# EAGLE schematic Index Registers - 1.1 (EAGLE 9.6.2)

## Sheet 1 of 8: R0
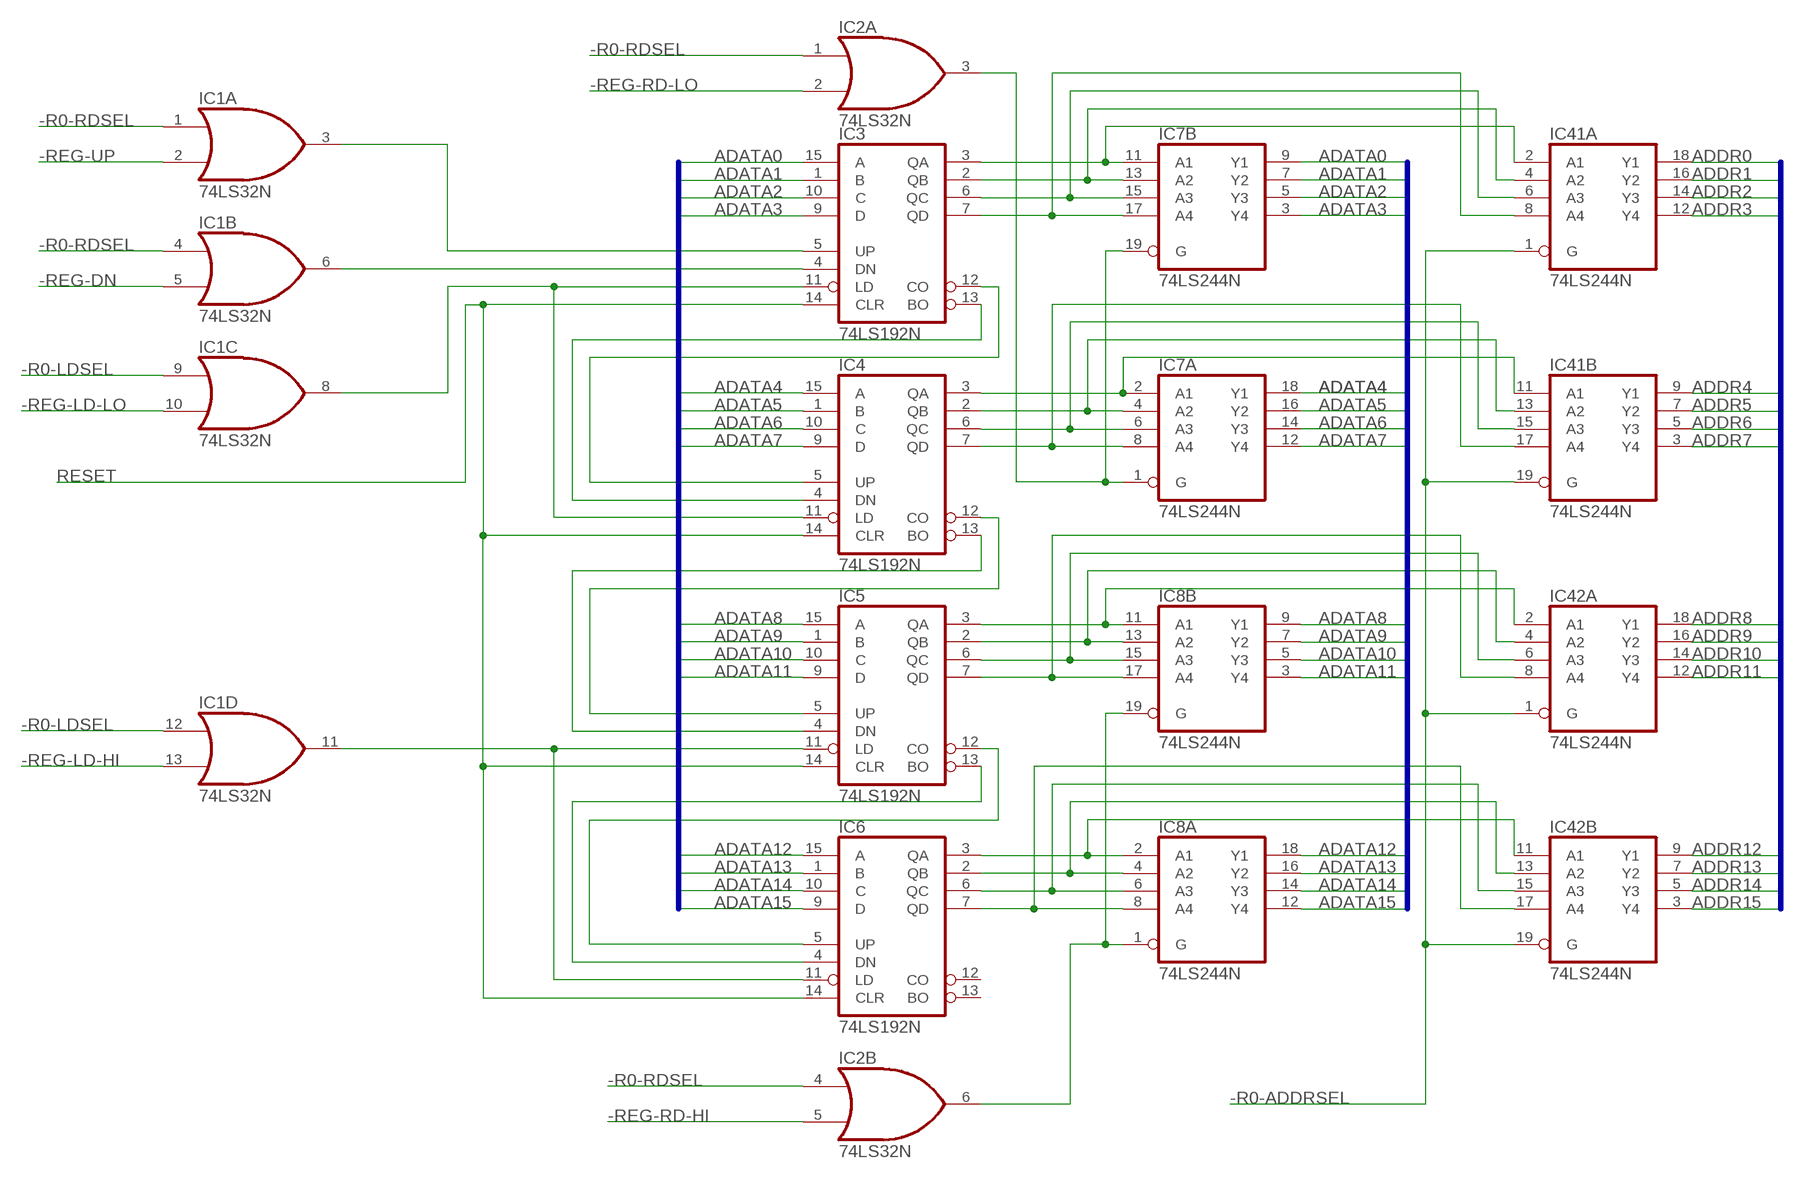
[diagram p0: schematic, sheet 1]

### Parts
IC1  74LS32N  [DIL14]
IC2  74LS32N  [DIL14]
IC3  74LS192N  [DIL16]
IC4  74LS192N  [DIL16]
IC5  74LS192N  [DIL16]
IC6  74LS192N  [DIL16]
IC7  74LS244N  [DIL20]
IC8  74LS244N  [DIL20]
IC41  74LS244N  [DIL20]
IC42  74LS244N  [DIL20]

### Nets
-R0-ADDRSEL: IC41.1(A:G) IC41.19(B:G) IC42.1(A:G) IC42.19(B:G) ; also sheet 6
-R0-LDSEL: IC1.9(C:I0) IC1.12(D:I0) ; also sheet 6
-R0-RDSEL: IC1.1(A:I0) IC1.4(B:I0) IC2.1(A:I0) IC2.4(B:I0) ; also sheet 6
-REG-DN: IC1.5(B:I1) ; also sheet 2,3,4,8
-REG-LD-HI: IC1.13(D:I1) ; also sheet 2,3,4,8
-REG-LD-LO: IC1.10(C:I1) ; also sheet 2,3,4,8
-REG-RD-HI: IC2.5(B:I1) ; also sheet 2,3,4,8
-REG-RD-LO: IC2.2(A:I1) ; also sheet 2,3,4,8
-REG-UP: IC1.2(A:I1) ; also sheet 2,3,4,8
ADATA0: IC3.15(A) IC7.9(B:Y1) ; also sheet 2,3,4,5,7
ADATA1: IC3.1(B) IC7.7(B:Y2) ; also sheet 2,3,4,5,7
ADATA2: IC3.10(C) IC7.5(B:Y3) ; also sheet 2,3,4,5,7
ADATA3: IC3.9(D) IC7.3(B:Y4) ; also sheet 2,3,4,5,7
ADATA4: IC4.15(A) IC7.18(A:Y1) ; also sheet 2,3,4,5,7
ADATA5: IC4.1(B) IC7.16(A:Y2) ; also sheet 2,3,4,5,7
ADATA6: IC4.10(C) IC7.14(A:Y3) ; also sheet 2,3,4,5,7
ADATA7: IC4.9(D) IC7.12(A:Y4) ; also sheet 2,3,4,5,7
ADATA8: IC5.15(A) IC8.9(B:Y1) ; also sheet 2,3,4,5,7
ADATA9: IC5.1(B) IC8.7(B:Y2) ; also sheet 2,3,4,5,7
ADATA10: IC5.10(C) IC8.5(B:Y3) ; also sheet 2,3,4,5,7
ADATA11: IC5.9(D) IC8.3(B:Y4) ; also sheet 2,3,4,5,7
ADATA12: IC6.15(A) IC8.18(A:Y1) ; also sheet 2,3,4,5,7
ADATA13: IC6.1(B) IC8.16(A:Y2) ; also sheet 2,3,4,5,7
ADATA14: IC6.10(C) IC8.14(A:Y3) ; also sheet 2,3,4,5,7
ADATA15: IC6.9(D) IC8.12(A:Y4) ; also sheet 2,3,4,5,7
ADDR0: IC41.18(A:Y1) ; also sheet 2,3,4,8
ADDR1: IC41.16(A:Y2) ; also sheet 2,3,4,8
ADDR2: IC41.14(A:Y3) ; also sheet 2,3,4,8
ADDR3: IC41.12(A:Y4) ; also sheet 2,3,4,8
ADDR4: IC41.9(B:Y1) ; also sheet 2,3,4,8
ADDR5: IC41.7(B:Y2) ; also sheet 2,3,4,8
ADDR6: IC41.5(B:Y3) ; also sheet 2,3,4,8
ADDR7: IC41.3(B:Y4) ; also sheet 2,3,4,8
ADDR8: IC42.18(A:Y1) ; also sheet 2,3,4,8
ADDR9: IC42.16(A:Y2) ; also sheet 2,3,4,8
ADDR10: IC42.14(A:Y3) ; also sheet 2,3,4,8
ADDR11: IC42.12(A:Y4) ; also sheet 2,3,4,8
ADDR12: IC42.9(B:Y1) ; also sheet 2,3,4,8
ADDR13: IC42.7(B:Y2) ; also sheet 2,3,4,8
ADDR14: IC42.5(B:Y3) ; also sheet 2,3,4,8
ADDR15: IC42.3(B:Y4) ; also sheet 2,3,4,8
N$10: IC3.13(BO) IC4.4(DN)
N$11: IC3.12(CO) IC4.5(UP)
N$12: IC4.13(BO) IC5.4(DN)
N$13: IC4.12(CO) IC5.5(UP)
N$14: IC5.13(BO) IC6.4(DN)
N$15: IC5.12(CO) IC6.5(UP)
N$16: IC1.8(C:O) IC3.11(LD) IC4.11(LD)
N$17: IC1.3(A:O) IC3.5(UP)
N$18: IC1.6(B:O) IC3.4(DN)
N$20: IC2.3(A:O) IC7.1(A:G) IC7.19(B:G)
N$21: IC2.6(B:O) IC8.1(A:G) IC8.19(B:G)
N$22: IC1.11(D:O) IC5.11(LD) IC6.11(LD)
N$115: IC3.3(QA) IC7.11(B:A1) IC41.2(A:A1)
N$116: IC3.2(QB) IC7.13(B:A2) IC41.4(A:A2)
N$117: IC3.6(QC) IC7.15(B:A3) IC41.6(A:A3)
N$118: IC3.7(QD) IC7.17(B:A4) IC41.8(A:A4)
N$119: IC4.3(QA) IC7.2(A:A1) IC41.11(B:A1)
N$120: IC4.2(QB) IC7.4(A:A2) IC41.13(B:A2)
N$121: IC4.6(QC) IC7.6(A:A3) IC41.15(B:A3)
N$122: IC4.7(QD) IC7.8(A:A4) IC41.17(B:A4)
N$123: IC5.3(QA) IC8.11(B:A1) IC42.2(A:A1)
N$124: IC5.2(QB) IC8.13(B:A2) IC42.4(A:A2)
N$125: IC5.6(QC) IC8.15(B:A3) IC42.6(A:A3)
N$126: IC5.7(QD) IC8.17(B:A4) IC42.8(A:A4)
N$127: IC6.3(QA) IC8.2(A:A1) IC42.11(B:A1)
N$128: IC6.2(QB) IC8.4(A:A2) IC42.13(B:A2)
N$129: IC6.6(QC) IC8.6(A:A3) IC42.15(B:A3)
N$130: IC6.7(QD) IC8.8(A:A4) IC42.17(B:A4)
RESET: IC3.14(CLR) IC4.14(CLR) IC5.14(CLR) IC6.14(CLR) ; also sheet 2,3,4,7
Unconnected: IC6.12(CO) IC6.13(BO)

### Buses
ADATA[0..15]
ADDRBUS:ADDR[0..15]

## Sheet 2 of 8: R1
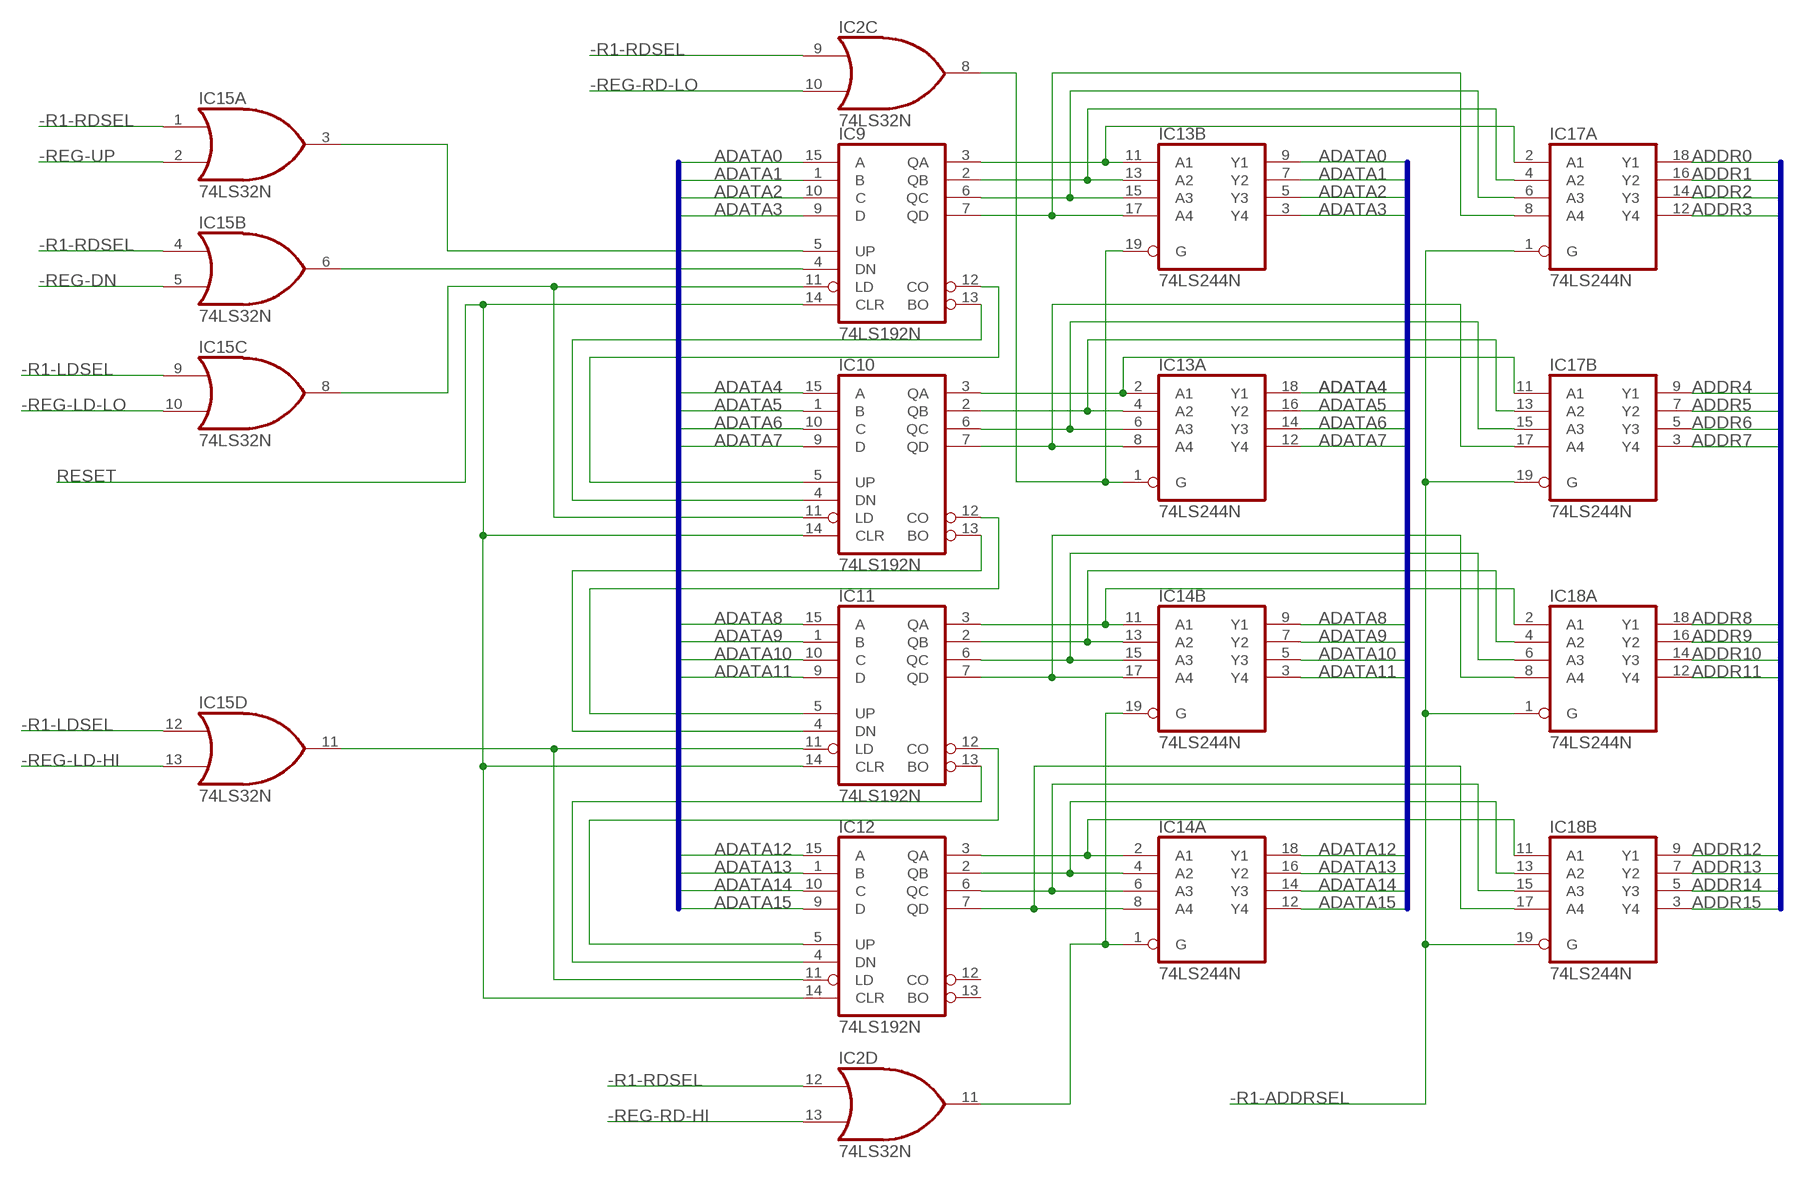
[diagram p1: schematic, sheet 2]

### Parts
IC9  74LS192N  [DIL16]
IC10  74LS192N  [DIL16]
IC11  74LS192N  [DIL16]
IC12  74LS192N  [DIL16]
IC13  74LS244N  [DIL20]
IC14  74LS244N  [DIL20]
IC15  74LS32N  [DIL14]
IC17  74LS244N  [DIL20]
IC18  74LS244N  [DIL20]

### Nets
-R1-ADDRSEL: IC17.1(A:G) IC17.19(B:G) IC18.1(A:G) IC18.19(B:G) ; also sheet 6
-R1-LDSEL: IC15.9(C:I0) IC15.12(D:I0) ; also sheet 6
-R1-RDSEL: IC2.9(C:I0) IC2.12(D:I0) IC15.1(A:I0) IC15.4(B:I0) ; also sheet 6
-REG-DN: IC15.5(B:I1) ; also sheet 1,3,4,8
-REG-LD-HI: IC15.13(D:I1) ; also sheet 1,3,4,8
-REG-LD-LO: IC15.10(C:I1) ; also sheet 1,3,4,8
-REG-RD-HI: IC2.13(D:I1) ; also sheet 1,3,4,8
-REG-RD-LO: IC2.10(C:I1) ; also sheet 1,3,4,8
-REG-UP: IC15.2(A:I1) ; also sheet 1,3,4,8
ADATA0: IC9.15(A) IC13.9(B:Y1) ; also sheet 1,3,4,5,7
ADATA1: IC9.1(B) IC13.7(B:Y2) ; also sheet 1,3,4,5,7
ADATA2: IC9.10(C) IC13.5(B:Y3) ; also sheet 1,3,4,5,7
ADATA3: IC9.9(D) IC13.3(B:Y4) ; also sheet 1,3,4,5,7
ADATA4: IC10.15(A) IC13.18(A:Y1) ; also sheet 1,3,4,5,7
ADATA5: IC10.1(B) IC13.16(A:Y2) ; also sheet 1,3,4,5,7
ADATA6: IC10.10(C) IC13.14(A:Y3) ; also sheet 1,3,4,5,7
ADATA7: IC10.9(D) IC13.12(A:Y4) ; also sheet 1,3,4,5,7
ADATA8: IC11.15(A) IC14.9(B:Y1) ; also sheet 1,3,4,5,7
ADATA9: IC11.1(B) IC14.7(B:Y2) ; also sheet 1,3,4,5,7
ADATA10: IC11.10(C) IC14.5(B:Y3) ; also sheet 1,3,4,5,7
ADATA11: IC11.9(D) IC14.3(B:Y4) ; also sheet 1,3,4,5,7
ADATA12: IC12.15(A) IC14.18(A:Y1) ; also sheet 1,3,4,5,7
ADATA13: IC12.1(B) IC14.16(A:Y2) ; also sheet 1,3,4,5,7
ADATA14: IC12.10(C) IC14.14(A:Y3) ; also sheet 1,3,4,5,7
ADATA15: IC12.9(D) IC14.12(A:Y4) ; also sheet 1,3,4,5,7
ADDR0: IC17.18(A:Y1) ; also sheet 1,3,4,8
ADDR1: IC17.16(A:Y2) ; also sheet 1,3,4,8
ADDR2: IC17.14(A:Y3) ; also sheet 1,3,4,8
ADDR3: IC17.12(A:Y4) ; also sheet 1,3,4,8
ADDR4: IC17.9(B:Y1) ; also sheet 1,3,4,8
ADDR5: IC17.7(B:Y2) ; also sheet 1,3,4,8
ADDR6: IC17.5(B:Y3) ; also sheet 1,3,4,8
ADDR7: IC17.3(B:Y4) ; also sheet 1,3,4,8
ADDR8: IC18.18(A:Y1) ; also sheet 1,3,4,8
ADDR9: IC18.16(A:Y2) ; also sheet 1,3,4,8
ADDR10: IC18.14(A:Y3) ; also sheet 1,3,4,8
ADDR11: IC18.12(A:Y4) ; also sheet 1,3,4,8
ADDR12: IC18.9(B:Y1) ; also sheet 1,3,4,8
ADDR13: IC18.7(B:Y2) ; also sheet 1,3,4,8
ADDR14: IC18.5(B:Y3) ; also sheet 1,3,4,8
ADDR15: IC18.3(B:Y4) ; also sheet 1,3,4,8
N$2: IC9.13(BO) IC10.4(DN)
N$3: IC9.12(CO) IC10.5(UP)
N$4: IC10.13(BO) IC11.4(DN)
N$5: IC10.12(CO) IC11.5(UP)
N$6: IC11.13(BO) IC12.4(DN)
N$7: IC11.12(CO) IC12.5(UP)
N$8: IC9.11(LD) IC10.11(LD) IC15.8(C:O)
N$9: IC9.5(UP) IC15.3(A:O)
N$23: IC9.4(DN) IC15.6(B:O)
N$25: IC2.8(C:O) IC13.1(A:G) IC13.19(B:G)
N$26: IC2.11(D:O) IC14.1(A:G) IC14.19(B:G)
N$27: IC11.11(LD) IC12.11(LD) IC15.11(D:O)
N$28: IC9.3(QA) IC13.11(B:A1) IC17.2(A:A1)
N$29: IC9.2(QB) IC13.13(B:A2) IC17.4(A:A2)
N$30: IC9.6(QC) IC13.15(B:A3) IC17.6(A:A3)
N$31: IC9.7(QD) IC13.17(B:A4) IC17.8(A:A4)
N$32: IC10.3(QA) IC13.2(A:A1) IC17.11(B:A1)
N$33: IC10.2(QB) IC13.4(A:A2) IC17.13(B:A2)
N$34: IC10.6(QC) IC13.6(A:A3) IC17.15(B:A3)
N$35: IC10.7(QD) IC13.8(A:A4) IC17.17(B:A4)
N$36: IC11.3(QA) IC14.11(B:A1) IC18.2(A:A1)
N$38: IC11.2(QB) IC14.13(B:A2) IC18.4(A:A2)
N$39: IC11.6(QC) IC14.15(B:A3) IC18.6(A:A3)
N$40: IC11.7(QD) IC14.17(B:A4) IC18.8(A:A4)
N$54: IC12.3(QA) IC14.2(A:A1) IC18.11(B:A1)
N$55: IC12.2(QB) IC14.4(A:A2) IC18.13(B:A2)
N$56: IC12.6(QC) IC14.6(A:A3) IC18.15(B:A3)
N$57: IC12.7(QD) IC14.8(A:A4) IC18.17(B:A4)
RESET: IC9.14(CLR) IC10.14(CLR) IC11.14(CLR) IC12.14(CLR) ; also sheet 1,3,4,7
Unconnected: IC12.12(CO) IC12.13(BO)

### Buses
ADATA[0..15]
ADDRBUS:ADDR[0..15]

## Sheet 3 of 8: R2
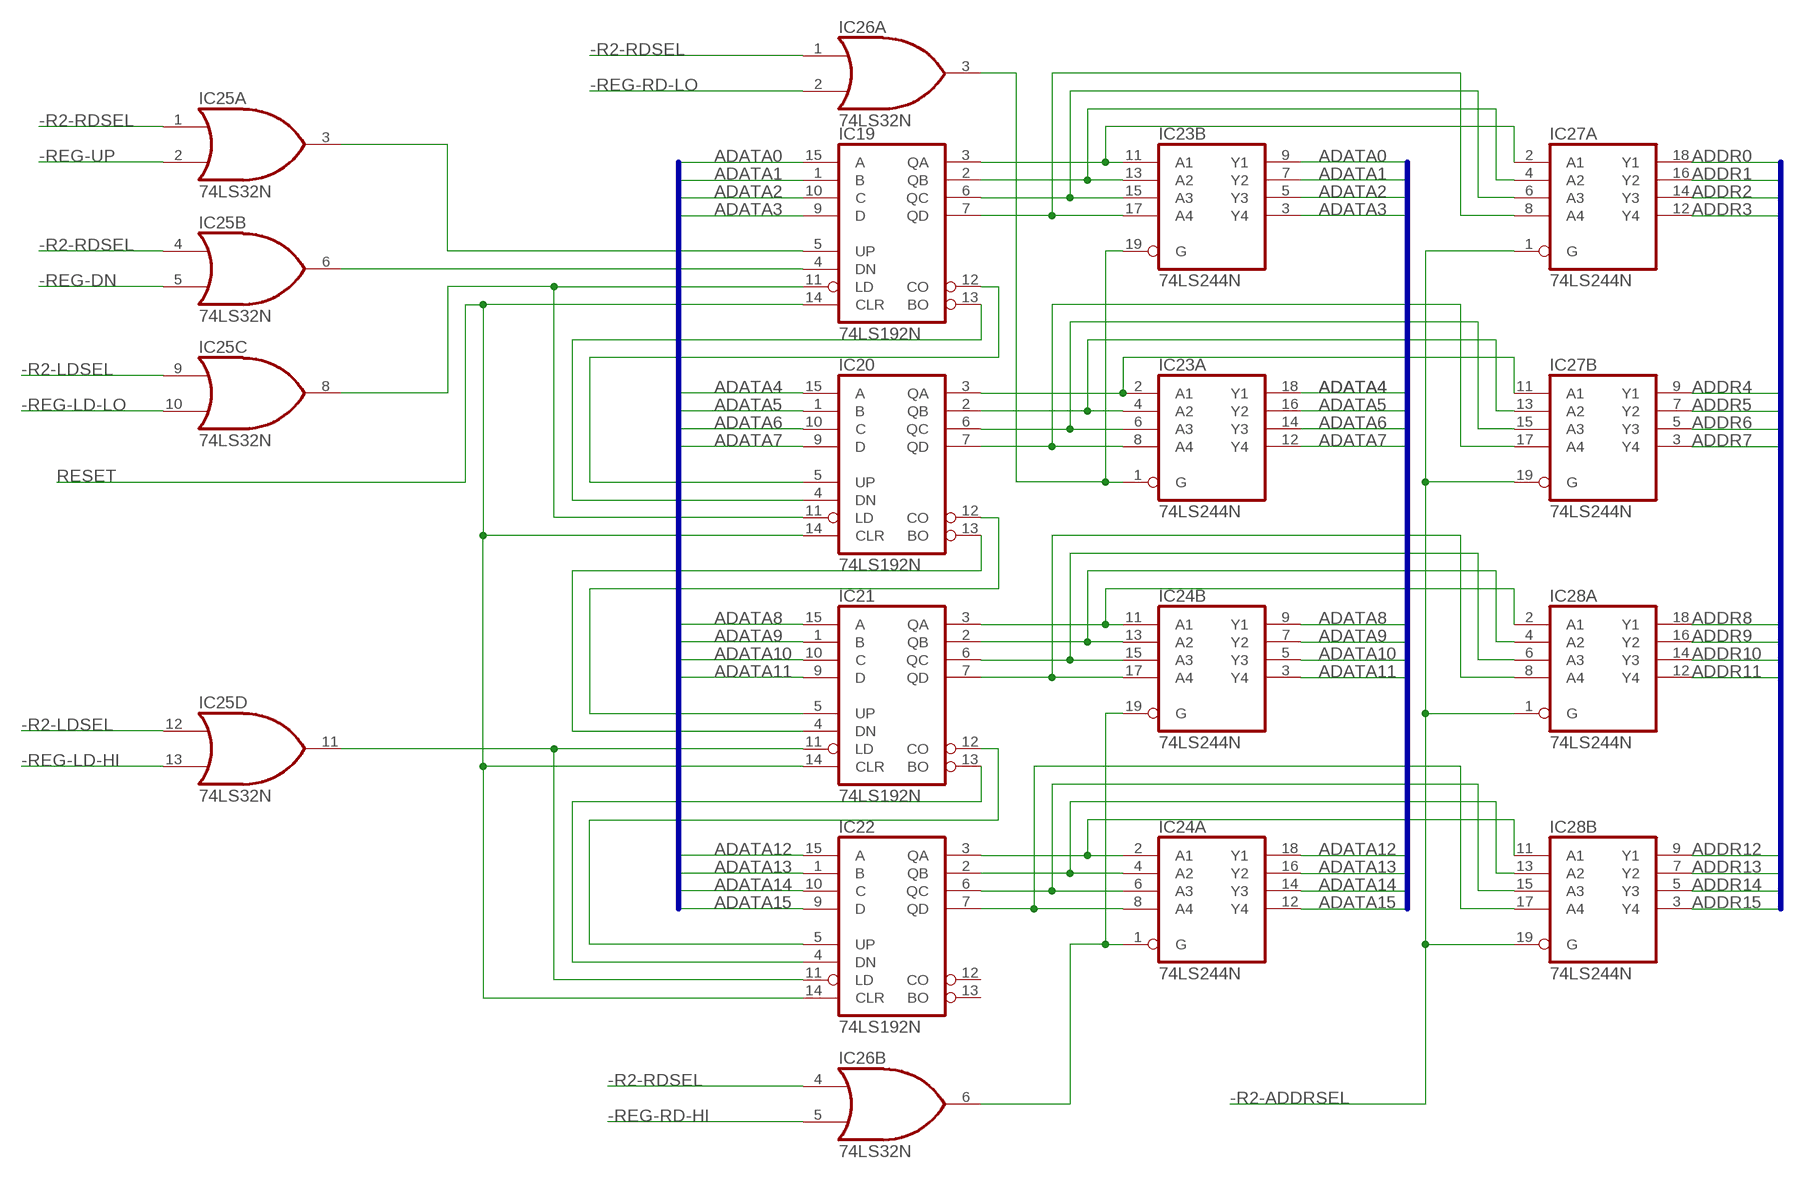
[diagram p2: schematic, sheet 3]

### Parts
IC19  74LS192N  [DIL16]
IC20  74LS192N  [DIL16]
IC21  74LS192N  [DIL16]
IC22  74LS192N  [DIL16]
IC23  74LS244N  [DIL20]
IC24  74LS244N  [DIL20]
IC25  74LS32N  [DIL14]
IC26  74LS32N  [DIL14]
IC27  74LS244N  [DIL20]
IC28  74LS244N  [DIL20]

### Nets
-R2-ADDRSEL: IC27.1(A:G) IC27.19(B:G) IC28.1(A:G) IC28.19(B:G) ; also sheet 6
-R2-LDSEL: IC25.9(C:I0) IC25.12(D:I0) ; also sheet 6
-R2-RDSEL: IC25.1(A:I0) IC25.4(B:I0) IC26.1(A:I0) IC26.4(B:I0) ; also sheet 6
-REG-DN: IC25.5(B:I1) ; also sheet 1,2,4,8
-REG-LD-HI: IC25.13(D:I1) ; also sheet 1,2,4,8
-REG-LD-LO: IC25.10(C:I1) ; also sheet 1,2,4,8
-REG-RD-HI: IC26.5(B:I1) ; also sheet 1,2,4,8
-REG-RD-LO: IC26.2(A:I1) ; also sheet 1,2,4,8
-REG-UP: IC25.2(A:I1) ; also sheet 1,2,4,8
ADATA0: IC19.15(A) IC23.9(B:Y1) ; also sheet 1,2,4,5,7
ADATA1: IC19.1(B) IC23.7(B:Y2) ; also sheet 1,2,4,5,7
ADATA2: IC19.10(C) IC23.5(B:Y3) ; also sheet 1,2,4,5,7
ADATA3: IC19.9(D) IC23.3(B:Y4) ; also sheet 1,2,4,5,7
ADATA4: IC20.15(A) IC23.18(A:Y1) ; also sheet 1,2,4,5,7
ADATA5: IC20.1(B) IC23.16(A:Y2) ; also sheet 1,2,4,5,7
ADATA6: IC20.10(C) IC23.14(A:Y3) ; also sheet 1,2,4,5,7
ADATA7: IC20.9(D) IC23.12(A:Y4) ; also sheet 1,2,4,5,7
ADATA8: IC21.15(A) IC24.9(B:Y1) ; also sheet 1,2,4,5,7
ADATA9: IC21.1(B) IC24.7(B:Y2) ; also sheet 1,2,4,5,7
ADATA10: IC21.10(C) IC24.5(B:Y3) ; also sheet 1,2,4,5,7
ADATA11: IC21.9(D) IC24.3(B:Y4) ; also sheet 1,2,4,5,7
ADATA12: IC22.15(A) IC24.18(A:Y1) ; also sheet 1,2,4,5,7
ADATA13: IC22.1(B) IC24.16(A:Y2) ; also sheet 1,2,4,5,7
ADATA14: IC22.10(C) IC24.14(A:Y3) ; also sheet 1,2,4,5,7
ADATA15: IC22.9(D) IC24.12(A:Y4) ; also sheet 1,2,4,5,7
ADDR0: IC27.18(A:Y1) ; also sheet 1,2,4,8
ADDR1: IC27.16(A:Y2) ; also sheet 1,2,4,8
ADDR2: IC27.14(A:Y3) ; also sheet 1,2,4,8
ADDR3: IC27.12(A:Y4) ; also sheet 1,2,4,8
ADDR4: IC27.9(B:Y1) ; also sheet 1,2,4,8
ADDR5: IC27.7(B:Y2) ; also sheet 1,2,4,8
ADDR6: IC27.5(B:Y3) ; also sheet 1,2,4,8
ADDR7: IC27.3(B:Y4) ; also sheet 1,2,4,8
ADDR8: IC28.18(A:Y1) ; also sheet 1,2,4,8
ADDR9: IC28.16(A:Y2) ; also sheet 1,2,4,8
ADDR10: IC28.14(A:Y3) ; also sheet 1,2,4,8
ADDR11: IC28.12(A:Y4) ; also sheet 1,2,4,8
ADDR12: IC28.9(B:Y1) ; also sheet 1,2,4,8
ADDR13: IC28.7(B:Y2) ; also sheet 1,2,4,8
ADDR14: IC28.5(B:Y3) ; also sheet 1,2,4,8
ADDR15: IC28.3(B:Y4) ; also sheet 1,2,4,8
N$58: IC19.13(BO) IC20.4(DN)
N$59: IC19.12(CO) IC20.5(UP)
N$60: IC20.13(BO) IC21.4(DN)
N$61: IC20.12(CO) IC21.5(UP)
N$62: IC21.13(BO) IC22.4(DN)
N$63: IC21.12(CO) IC22.5(UP)
N$64: IC19.11(LD) IC20.11(LD) IC25.8(C:O)
N$65: IC19.5(UP) IC25.3(A:O)
N$66: IC19.4(DN) IC25.6(B:O)
N$67: IC23.1(A:G) IC23.19(B:G) IC26.3(A:O)
N$68: IC24.1(A:G) IC24.19(B:G) IC26.6(B:O)
N$69: IC21.11(LD) IC22.11(LD) IC25.11(D:O)
N$70: IC19.3(QA) IC23.11(B:A1) IC27.2(A:A1)
N$71: IC19.2(QB) IC23.13(B:A2) IC27.4(A:A2)
N$72: IC19.6(QC) IC23.15(B:A3) IC27.6(A:A3)
N$73: IC19.7(QD) IC23.17(B:A4) IC27.8(A:A4)
N$74: IC20.3(QA) IC23.2(A:A1) IC27.11(B:A1)
N$75: IC20.2(QB) IC23.4(A:A2) IC27.13(B:A2)
N$76: IC20.6(QC) IC23.6(A:A3) IC27.15(B:A3)
N$77: IC20.7(QD) IC23.8(A:A4) IC27.17(B:A4)
N$78: IC21.3(QA) IC24.11(B:A1) IC28.2(A:A1)
N$79: IC21.2(QB) IC24.13(B:A2) IC28.4(A:A2)
N$80: IC21.6(QC) IC24.15(B:A3) IC28.6(A:A3)
N$81: IC21.7(QD) IC24.17(B:A4) IC28.8(A:A4)
N$82: IC22.3(QA) IC24.2(A:A1) IC28.11(B:A1)
N$83: IC22.2(QB) IC24.4(A:A2) IC28.13(B:A2)
N$84: IC22.6(QC) IC24.6(A:A3) IC28.15(B:A3)
N$85: IC22.7(QD) IC24.8(A:A4) IC28.17(B:A4)
RESET: IC19.14(CLR) IC20.14(CLR) IC21.14(CLR) IC22.14(CLR) ; also sheet 1,2,4,7
Unconnected: IC22.12(CO) IC22.13(BO)

### Buses
ADATA[0..15]
ADDRBUS:ADDR[0..15]

## Sheet 4 of 8: R3
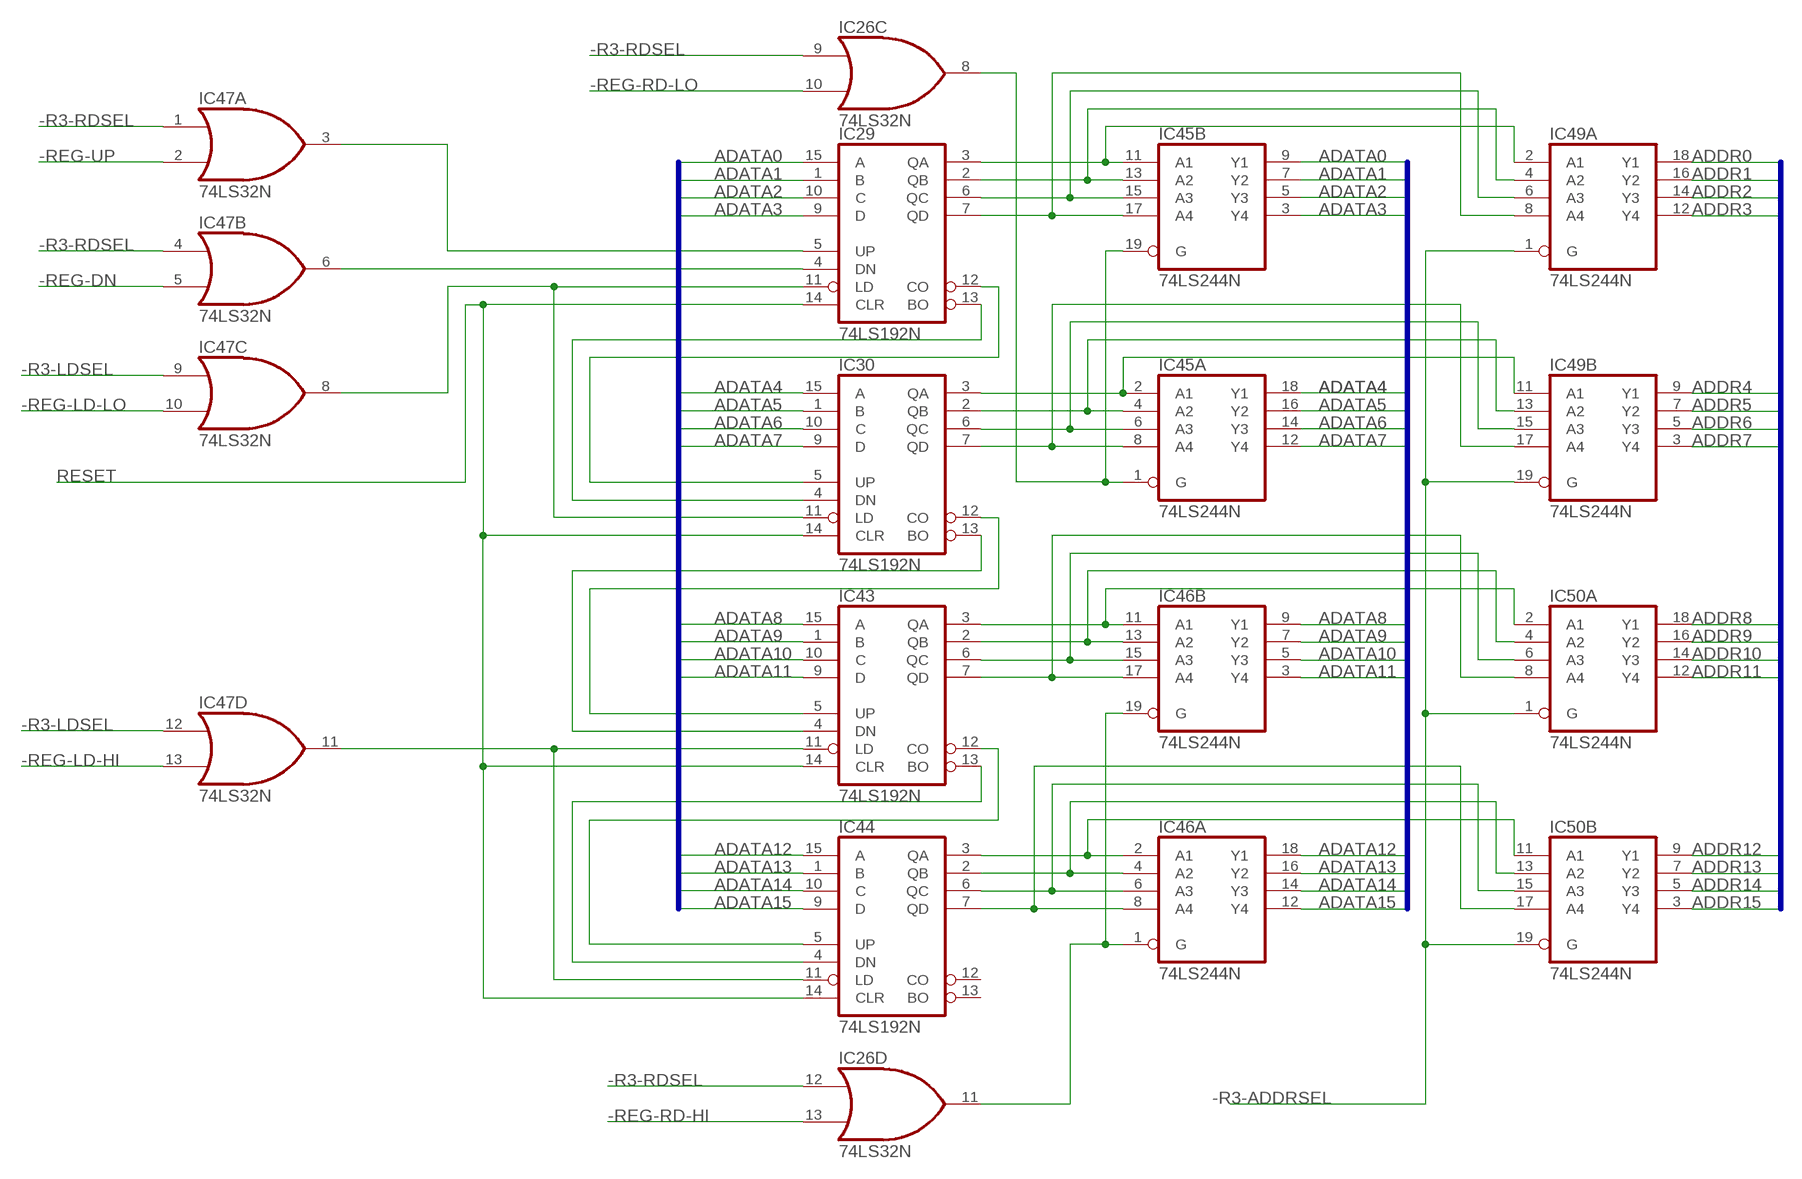
[diagram p3: schematic, sheet 4]

### Parts
IC29  74LS192N  [DIL16]
IC30  74LS192N  [DIL16]
IC43  74LS192N  [DIL16]
IC44  74LS192N  [DIL16]
IC45  74LS244N  [DIL20]
IC46  74LS244N  [DIL20]
IC47  74LS32N  [DIL14]
IC49  74LS244N  [DIL20]
IC50  74LS244N  [DIL20]

### Nets
-R3-ADDRSEL: IC49.1(A:G) IC49.19(B:G) IC50.1(A:G) IC50.19(B:G) ; also sheet 6
-R3-LDSEL: IC47.9(C:I0) IC47.12(D:I0) ; also sheet 6
-R3-RDSEL: IC26.9(C:I0) IC26.12(D:I0) IC47.1(A:I0) IC47.4(B:I0) ; also sheet 6
-REG-DN: IC47.5(B:I1) ; also sheet 1,2,3,8
-REG-LD-HI: IC47.13(D:I1) ; also sheet 1,2,3,8
-REG-LD-LO: IC47.10(C:I1) ; also sheet 1,2,3,8
-REG-RD-HI: IC26.13(D:I1) ; also sheet 1,2,3,8
-REG-RD-LO: IC26.10(C:I1) ; also sheet 1,2,3,8
-REG-UP: IC47.2(A:I1) ; also sheet 1,2,3,8
ADATA0: IC29.15(A) IC45.9(B:Y1) ; also sheet 1,2,3,5,7
ADATA1: IC29.1(B) IC45.7(B:Y2) ; also sheet 1,2,3,5,7
ADATA2: IC29.10(C) IC45.5(B:Y3) ; also sheet 1,2,3,5,7
ADATA3: IC29.9(D) IC45.3(B:Y4) ; also sheet 1,2,3,5,7
ADATA4: IC30.15(A) IC45.18(A:Y1) ; also sheet 1,2,3,5,7
ADATA5: IC30.1(B) IC45.16(A:Y2) ; also sheet 1,2,3,5,7
ADATA6: IC30.10(C) IC45.14(A:Y3) ; also sheet 1,2,3,5,7
ADATA7: IC30.9(D) IC45.12(A:Y4) ; also sheet 1,2,3,5,7
ADATA8: IC43.15(A) IC46.9(B:Y1) ; also sheet 1,2,3,5,7
ADATA9: IC43.1(B) IC46.7(B:Y2) ; also sheet 1,2,3,5,7
ADATA10: IC43.10(C) IC46.5(B:Y3) ; also sheet 1,2,3,5,7
ADATA11: IC43.9(D) IC46.3(B:Y4) ; also sheet 1,2,3,5,7
ADATA12: IC44.15(A) IC46.18(A:Y1) ; also sheet 1,2,3,5,7
ADATA13: IC44.1(B) IC46.16(A:Y2) ; also sheet 1,2,3,5,7
ADATA14: IC44.10(C) IC46.14(A:Y3) ; also sheet 1,2,3,5,7
ADATA15: IC44.9(D) IC46.12(A:Y4) ; also sheet 1,2,3,5,7
ADDR0: IC49.18(A:Y1) ; also sheet 1,2,3,8
ADDR1: IC49.16(A:Y2) ; also sheet 1,2,3,8
ADDR2: IC49.14(A:Y3) ; also sheet 1,2,3,8
ADDR3: IC49.12(A:Y4) ; also sheet 1,2,3,8
ADDR4: IC49.9(B:Y1) ; also sheet 1,2,3,8
ADDR5: IC49.7(B:Y2) ; also sheet 1,2,3,8
ADDR6: IC49.5(B:Y3) ; also sheet 1,2,3,8
ADDR7: IC49.3(B:Y4) ; also sheet 1,2,3,8
ADDR8: IC50.18(A:Y1) ; also sheet 1,2,3,8
ADDR9: IC50.16(A:Y2) ; also sheet 1,2,3,8
ADDR10: IC50.14(A:Y3) ; also sheet 1,2,3,8
ADDR11: IC50.12(A:Y4) ; also sheet 1,2,3,8
ADDR12: IC50.9(B:Y1) ; also sheet 1,2,3,8
ADDR13: IC50.7(B:Y2) ; also sheet 1,2,3,8
ADDR14: IC50.5(B:Y3) ; also sheet 1,2,3,8
ADDR15: IC50.3(B:Y4) ; also sheet 1,2,3,8
N$86: IC29.13(BO) IC30.4(DN)
N$87: IC29.12(CO) IC30.5(UP)
N$88: IC30.13(BO) IC43.4(DN)
N$89: IC30.12(CO) IC43.5(UP)
N$90: IC43.13(BO) IC44.4(DN)
N$91: IC43.12(CO) IC44.5(UP)
N$92: IC29.11(LD) IC30.11(LD) IC47.8(C:O)
N$93: IC29.5(UP) IC47.3(A:O)
N$94: IC29.4(DN) IC47.6(B:O)
N$95: IC26.8(C:O) IC45.1(A:G) IC45.19(B:G)
N$96: IC26.11(D:O) IC46.1(A:G) IC46.19(B:G)
N$97: IC43.11(LD) IC44.11(LD) IC47.11(D:O)
N$98: IC29.3(QA) IC45.11(B:A1) IC49.2(A:A1)
N$99: IC29.2(QB) IC45.13(B:A2) IC49.4(A:A2)
N$100: IC29.6(QC) IC45.15(B:A3) IC49.6(A:A3)
N$101: IC29.7(QD) IC45.17(B:A4) IC49.8(A:A4)
N$102: IC30.3(QA) IC45.2(A:A1) IC49.11(B:A1)
N$103: IC30.2(QB) IC45.4(A:A2) IC49.13(B:A2)
N$104: IC30.6(QC) IC45.6(A:A3) IC49.15(B:A3)
N$105: IC30.7(QD) IC45.8(A:A4) IC49.17(B:A4)
N$106: IC43.3(QA) IC46.11(B:A1) IC50.2(A:A1)
N$107: IC43.2(QB) IC46.13(B:A2) IC50.4(A:A2)
N$108: IC43.6(QC) IC46.15(B:A3) IC50.6(A:A3)
N$109: IC43.7(QD) IC46.17(B:A4) IC50.8(A:A4)
N$110: IC44.3(QA) IC46.2(A:A1) IC50.11(B:A1)
N$111: IC44.2(QB) IC46.4(A:A2) IC50.13(B:A2)
N$112: IC44.6(QC) IC46.6(A:A3) IC50.15(B:A3)
N$113: IC44.7(QD) IC46.8(A:A4) IC50.17(B:A4)
RESET: IC29.14(CLR) IC30.14(CLR) IC43.14(CLR) IC44.14(CLR) ; also sheet 1,2,3,7
Unconnected: IC44.12(CO) IC44.13(BO)

### Buses
ADATA[0..15]
ADDRBUS:ADDR[0..15]

## Sheet 5 of 8: PULLUPS & BYPASS & UNUSED
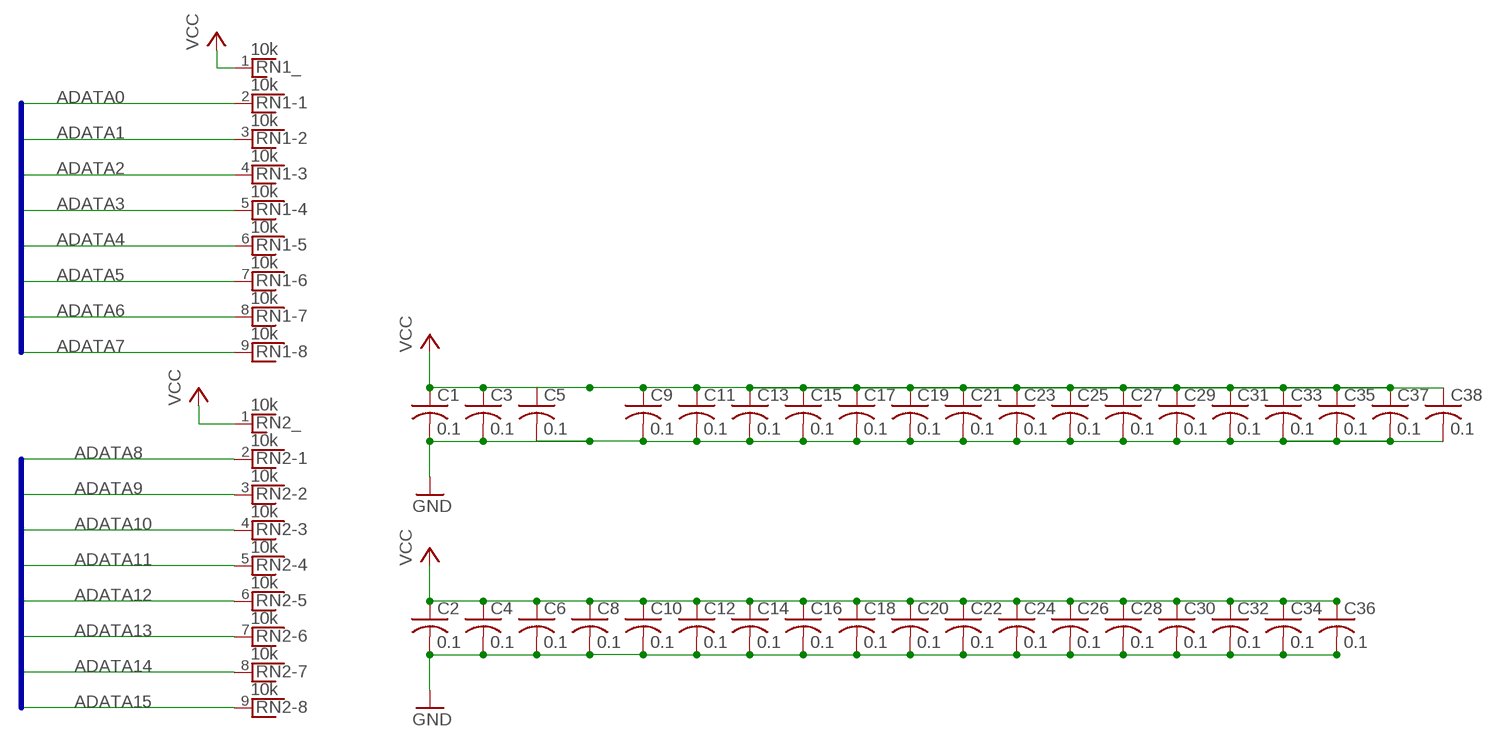
[diagram p4: schematic, sheet 5]

### Parts
C1  0.1  C-US025-040X050  [C025-040X050]
C2  0.1  C-US025-040X050  [C025-040X050]
C3  0.1  C-US025-040X050  [C025-040X050]
C4  0.1  C-US025-040X050  [C025-040X050]
C5  0.1  C-US025-040X050  [C025-040X050]
C6  0.1  C-US025-040X050  [C025-040X050]
C8  0.1  C-US025-040X050  [C025-040X050]
C9  0.1  C-US025-040X050  [C025-040X050]
C10  0.1  C-US025-040X050  [C025-040X050]
C11  0.1  C-US025-040X050  [C025-040X050]
C12  0.1  C-US025-040X050  [C025-040X050]
C13  0.1  C-US025-040X050  [C025-040X050]
C14  0.1  C-US025-040X050  [C025-040X050]
C15  0.1  C-US025-040X050  [C025-040X050]
C16  0.1  C-US025-040X050  [C025-040X050]
C17  0.1  C-US025-040X050  [C025-040X050]
C18  0.1  C-US025-040X050  [C025-040X050]
C19  0.1  C-US025-040X050  [C025-040X050]
C20  0.1  C-US025-040X050  [C025-040X050]
C21  0.1  C-US025-040X050  [C025-040X050]
C22  0.1  C-US025-040X050  [C025-040X050]
C23  0.1  C-US025-040X050  [C025-040X050]
C24  0.1  C-US025-040X050  [C025-040X050]
C25  0.1  C-US025-040X050  [C025-040X050]
C26  0.1  C-US025-040X050  [C025-040X050]
C27  0.1  C-US025-040X050  [C025-040X050]
C28  0.1  C-US025-040X050  [C025-040X050]
C29  0.1  C-US025-040X050  [C025-040X050]
C30  0.1  C-US025-040X050  [C025-040X050]
C31  0.1  C-US025-040X050  [C025-040X050]
C32  0.1  C-US025-040X050  [C025-040X050]
C33  0.1  C-US025-040X050  [C025-040X050]
C34  0.1  C-US025-040X050  [C025-040X050]
C35  0.1  C-US025-040X050  [C025-040X050]
C36  0.1  C-US025-040X050  [C025-040X050]
C37  0.1  C-US025-040X050  [C025-040X050]
C38  0.1  C-US025-040X050  [C025-040X050]
RN1  10k  RNX8  [RN-9]
RN2  10k  RNX8  [RN-9]

### Nets
ADATA0: RN1.2 ; also sheet 1,2,3,4,7
ADATA1: RN1.3 ; also sheet 1,2,3,4,7
ADATA2: RN1.4 ; also sheet 1,2,3,4,7
ADATA3: RN1.5 ; also sheet 1,2,3,4,7
ADATA4: RN1.6 ; also sheet 1,2,3,4,7
ADATA5: RN1.7 ; also sheet 1,2,3,4,7
ADATA6: RN1.8 ; also sheet 1,2,3,4,7
ADATA7: RN1.9 ; also sheet 1,2,3,4,7
ADATA8: RN2.2 ; also sheet 1,2,3,4,7
ADATA9: RN2.3 ; also sheet 1,2,3,4,7
ADATA10: RN2.4 ; also sheet 1,2,3,4,7
ADATA11: RN2.5 ; also sheet 1,2,3,4,7
ADATA12: RN2.6 ; also sheet 1,2,3,4,7
ADATA13: RN2.7 ; also sheet 1,2,3,4,7
ADATA14: RN2.8 ; also sheet 1,2,3,4,7
ADATA15: RN2.9 ; also sheet 1,2,3,4,7
GND: C1.2 C2.2 C3.2 C4.2 C5.2 C6.2 C8.2 C9.2 C10.2 C11.2 C12.2 C13.2 C14.2 C15.2 C16.2 C17.2 C18.2 C19.2 C20.2 C21.2 C22.2 C23.2 C24.2 C25.2 C26.2 C27.2 C28.2 C29.2 C30.2 C31.2 C32.2 C33.2 C34.2 C35.2 C36.2 C37.2 C38.2 ; also sheet 7,8
VCC: C1.1 C2.1 C3.1 C4.1 C5.1 C6.1 C8.1 C9.1 C10.1 C11.1 C12.1 C13.1 C14.1 C15.1 C16.1 C17.1 C18.1 C19.1 C20.1 C21.1 C22.1 C23.1 C24.1 C25.1 C26.1 C27.1 C28.1 C29.1 C30.1 C31.1 C32.1 C33.1 C34.1 C35.1 C36.1 C37.1 C38.1 RN1.1 RN2.1 ; also sheet 8

### Buses
ADATA[0..7]
ADATA[8..15]

## Sheet 6 of 8: Select Logic
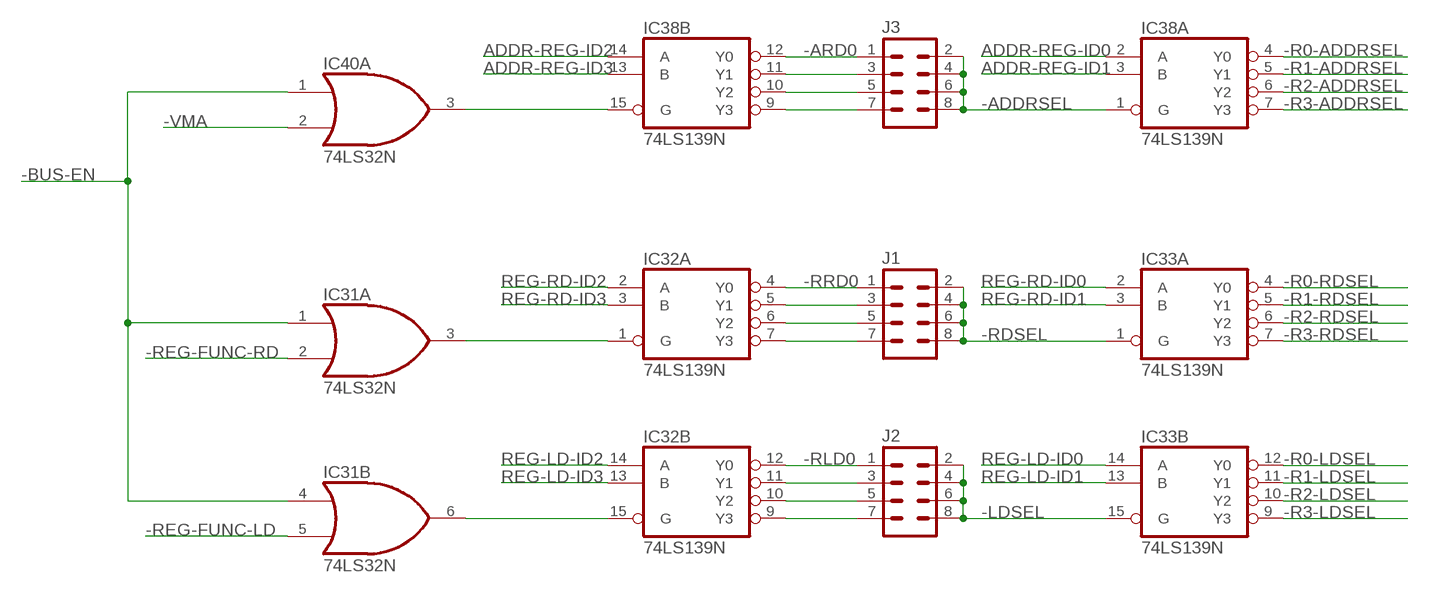
[diagram p5: schematic, sheet 6]

### Parts
IC31  74LS32N  [DIL14]
IC32  74LS139N  [DIL16]
IC33  74LS139N  [DIL16]
IC38  74LS139N  [DIL16]
IC40  74LS32N  [DIL14]
J1  M04X2  [2X4]
J2  M04X2  [2X4]
J3  M04X2  [2X4]

### Nets
-ADDRSEL: IC38.1(A:G) J3.2 J3.4 J3.6 J3.8
-ARD0: IC38.12(B:Y0) J3.1
-BUS-EN: IC31.1(A:I0) IC31.4(B:I0) IC40.1(A:I0) ; also sheet 8
-LDSEL: IC33.15(B:G) J2.2 J2.4 J2.6 J2.8 ; also sheet 7
-R0-ADDRSEL: IC38.4(A:Y0) ; also sheet 1
-R0-LDSEL: IC33.12(B:Y0) ; also sheet 1
-R0-RDSEL: IC33.4(A:Y0) ; also sheet 1
-R1-ADDRSEL: IC38.5(A:Y1) ; also sheet 2
-R1-LDSEL: IC33.11(B:Y1) ; also sheet 2
-R1-RDSEL: IC33.5(A:Y1) ; also sheet 2
-R2-ADDRSEL: IC38.6(A:Y2) ; also sheet 3
-R2-LDSEL: IC33.10(B:Y2) ; also sheet 3
-R2-RDSEL: IC33.6(A:Y2) ; also sheet 3
-R3-ADDRSEL: IC38.7(A:Y3) ; also sheet 4
-R3-LDSEL: IC33.9(B:Y3) ; also sheet 4
-R3-RDSEL: IC33.7(A:Y3) ; also sheet 4
-RDSEL: IC33.1(A:G) J1.2 J1.4 J1.6 J1.8 ; also sheet 7
-REG-FUNC-LD: IC31.5(B:I1) ; also sheet 8
-REG-FUNC-RD: IC31.2(A:I1) ; also sheet 8
-RLD0: IC32.12(B:Y0) J2.1
-RRD0: IC32.4(A:Y0) J1.1
-VMA: IC40.2(A:I1) ; also sheet 8
ADDR-REG-ID0: IC38.2(A:A) ; also sheet 8
ADDR-REG-ID1: IC38.3(A:B) ; also sheet 8
ADDR-REG-ID2: IC38.14(B:A) ; also sheet 8
ADDR-REG-ID3: IC38.13(B:B) ; also sheet 8
N$19: IC31.3(A:O) IC32.1(A:G)
N$24: IC31.6(B:O) IC32.15(B:G)
N$43: IC32.5(A:Y1) J1.3
N$45: IC38.15(B:G) IC40.3(A:O)
N$46: IC32.6(A:Y2) J1.5
N$47: IC32.7(A:Y3) J1.7
N$48: IC32.11(B:Y1) J2.3
N$49: IC32.10(B:Y2) J2.5
N$50: IC32.9(B:Y3) J2.7
N$51: IC38.11(B:Y1) J3.3
N$52: IC38.10(B:Y2) J3.5
N$53: IC38.9(B:Y3) J3.7
REG-LD-ID0: IC33.14(B:A) ; also sheet 8
REG-LD-ID1: IC33.13(B:B) ; also sheet 8
REG-LD-ID2: IC32.14(B:A) ; also sheet 8
REG-LD-ID3: IC32.13(B:B) ; also sheet 8
REG-RD-ID0: IC33.2(A:A) ; also sheet 8
REG-RD-ID1: IC33.3(A:B) ; also sheet 8
REG-RD-ID2: IC32.2(A:A) ; also sheet 8
REG-RD-ID3: IC32.3(A:B) ; also sheet 8
Unconnected: IC40.4(B:I0) IC40.5(B:I1) IC40.6(B:O) IC40.8(C:O) IC40.9(C:I0) IC40.10(C:I1) IC40.11(D:O) IC40.12(D:I0) IC40.13(D:I1)

## Sheet 7 of 8: bus buffering
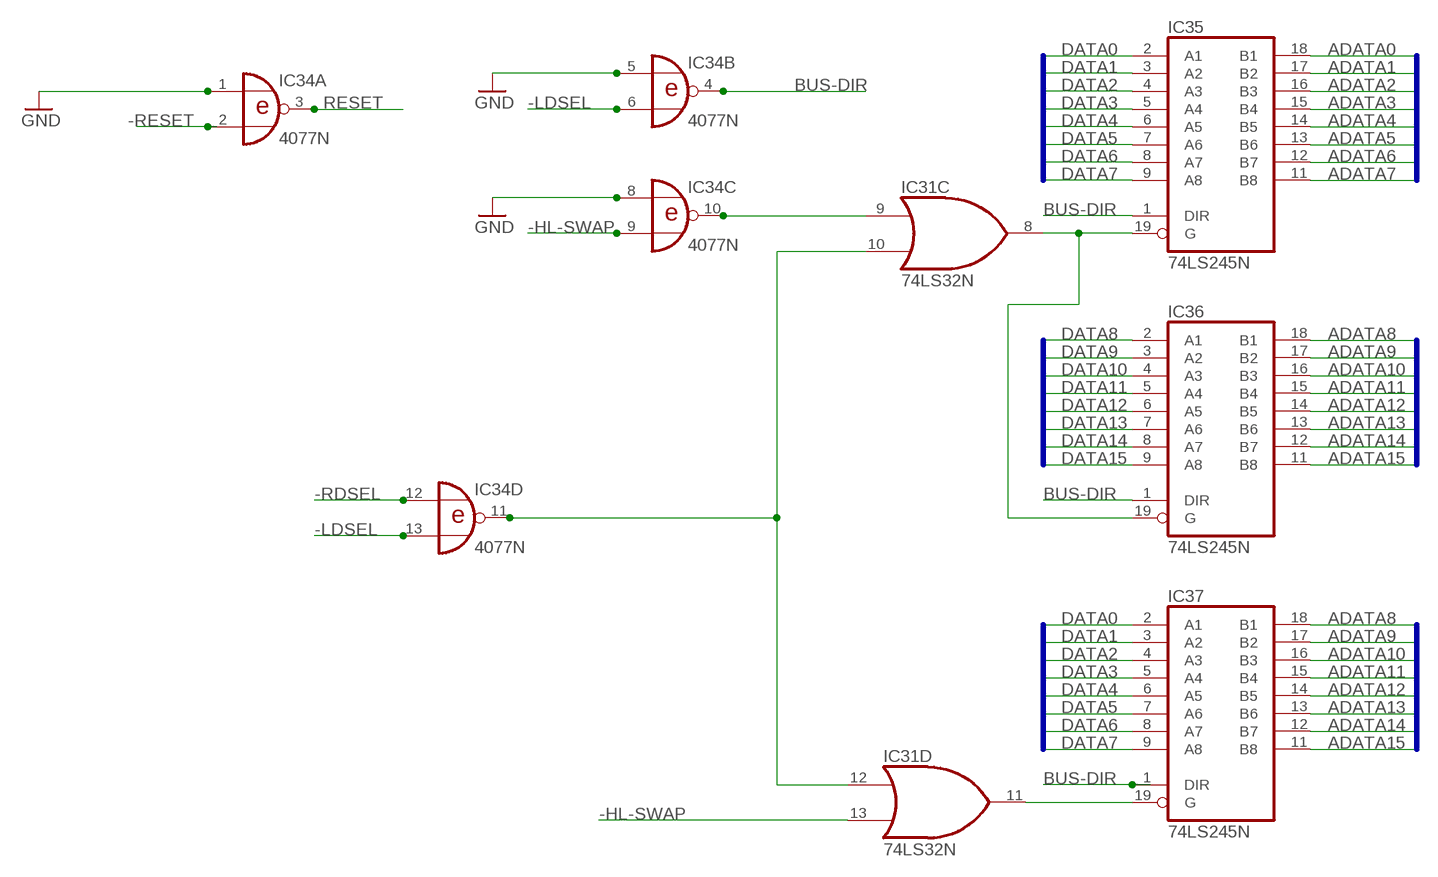
[diagram p6: schematic, sheet 7]

### Parts
IC34  4077N  [DIL14]
IC35  74LS245N  [DIL20]
IC36  74LS245N  [DIL20]
IC37  74LS245N  [DIL20]

### Nets
-HL-SWAP: IC31.13(D:I1) IC34.9(C:I1) ; also sheet 8
-LDSEL: IC34.6(B:I1) IC34.13(D:I1) ; also sheet 6
-RDSEL: IC34.12(D:I0) ; also sheet 6
-RESET: IC34.2(A:I1) ; also sheet 8
ADATA0: IC35.18(B1) ; also sheet 1,2,3,4,5
ADATA1: IC35.17(B2) ; also sheet 1,2,3,4,5
ADATA2: IC35.16(B3) ; also sheet 1,2,3,4,5
ADATA3: IC35.15(B4) ; also sheet 1,2,3,4,5
ADATA4: IC35.14(B5) ; also sheet 1,2,3,4,5
ADATA5: IC35.13(B6) ; also sheet 1,2,3,4,5
ADATA6: IC35.12(B7) ; also sheet 1,2,3,4,5
ADATA7: IC35.11(B8) ; also sheet 1,2,3,4,5
ADATA8: IC36.18(B1) IC37.18(B1) ; also sheet 1,2,3,4,5
ADATA9: IC36.17(B2) IC37.17(B2) ; also sheet 1,2,3,4,5
ADATA10: IC36.16(B3) IC37.16(B3) ; also sheet 1,2,3,4,5
ADATA11: IC36.15(B4) IC37.15(B4) ; also sheet 1,2,3,4,5
ADATA12: IC36.14(B5) IC37.14(B5) ; also sheet 1,2,3,4,5
ADATA13: IC36.13(B6) IC37.13(B6) ; also sheet 1,2,3,4,5
ADATA14: IC36.12(B7) IC37.12(B7) ; also sheet 1,2,3,4,5
ADATA15: IC36.11(B8) IC37.11(B8) ; also sheet 1,2,3,4,5
BUS-DIR: IC34.4(B:O) IC35.1(DIR) IC36.1(DIR) IC37.1(DIR)
DATA0: IC35.2(A1) IC37.2(A1) ; also sheet 8
DATA1: IC35.3(A2) IC37.3(A2) ; also sheet 8
DATA2: IC35.4(A3) IC37.4(A3) ; also sheet 8
DATA3: IC35.5(A4) IC37.5(A4) ; also sheet 8
DATA4: IC35.6(A5) IC37.6(A5) ; also sheet 8
DATA5: IC35.7(A6) IC37.7(A6) ; also sheet 8
DATA6: IC35.8(A7) IC37.8(A7) ; also sheet 8
DATA7: IC35.9(A8) IC37.9(A8) ; also sheet 8
DATA8: IC36.2(A1) ; also sheet 8
DATA9: IC36.3(A2) ; also sheet 8
DATA10: IC36.4(A3) ; also sheet 8
DATA11: IC36.5(A4) ; also sheet 8
DATA12: IC36.6(A5) ; also sheet 8
DATA13: IC36.7(A6) ; also sheet 8
DATA14: IC36.8(A7) ; also sheet 8
DATA15: IC36.9(A8) ; also sheet 8
GND: IC34.1(A:I0) IC34.5(B:I0) IC34.8(C:I0) ; also sheet 5,8
N$1: IC31.8(C:O) IC35.19(G) IC36.19(G)
N$37: IC31.11(D:O) IC37.19(G)
N$41: IC31.9(C:I0) IC34.10(C:O)
N$42: IC31.10(C:I1) IC31.12(D:I0) IC34.11(D:O)
RESET: IC34.3(A:O) ; also sheet 1,2,3,4

### Buses
DATA[8..15]
DATA[0..7]
ADATA[0..7]
ADATA[8..15]

## Sheet 8 of 8: BUS
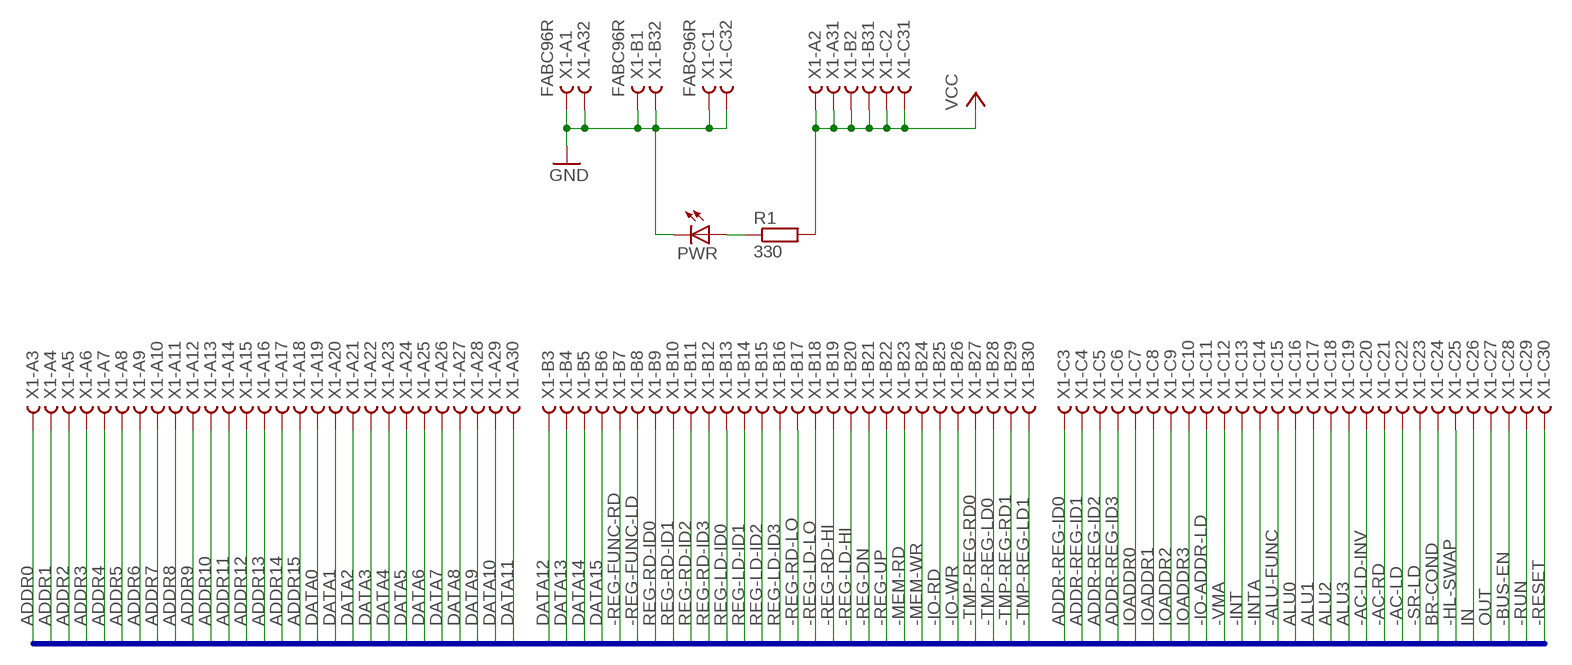
[diagram p7: schematic, sheet 8]

### Parts
PWR  LED5MM  [LED5MM]
R1  330  R0207/10  [0207/10]
X1  FABC96R  [FABC96R]

### Nets
-AC-LD: X1.C22
-AC-LD-INV: X1.C20
-AC-RD: X1.C21
-ALU-FUNC: X1.C15
-BUS-EN: X1.C28 ; also sheet 6
-HL-SWAP: X1.C25 ; also sheet 7
-INT: X1.C13
-INTA: X1.C14
-IO-ADDR-LD: X1.C11
-IO-RD: X1.B25
-IO-WR: X1.B26
-MEM-RD: X1.B23
-MEM-WR: X1.B24
-REG-DN: X1.B21 ; also sheet 1,2,3,4
-REG-FUNC-LD: X1.B8 ; also sheet 6
-REG-FUNC-RD: X1.B7 ; also sheet 6
-REG-LD-HI: X1.B20 ; also sheet 1,2,3,4
-REG-LD-LO: X1.B18 ; also sheet 1,2,3,4
-REG-RD-HI: X1.B19 ; also sheet 1,2,3,4
-REG-RD-LO: X1.B17 ; also sheet 1,2,3,4
-REG-UP: X1.B22 ; also sheet 1,2,3,4
-RESET: X1.C30 ; also sheet 7
-RUN: X1.C29
-SR-LD: X1.C23
-TMP-REG-LD0: X1.B28
-TMP-REG-LD1: X1.B30
-TMP-REG-RD0: X1.B27
-TMP-REG-RD1: X1.B29
-VMA: X1.C12 ; also sheet 6
ADDR0: X1.A3 ; also sheet 1,2,3,4
ADDR1: X1.A4 ; also sheet 1,2,3,4
ADDR2: X1.A5 ; also sheet 1,2,3,4
ADDR3: X1.A6 ; also sheet 1,2,3,4
ADDR4: X1.A7 ; also sheet 1,2,3,4
ADDR5: X1.A8 ; also sheet 1,2,3,4
ADDR6: X1.A9 ; also sheet 1,2,3,4
ADDR7: X1.A10 ; also sheet 1,2,3,4
ADDR8: X1.A11 ; also sheet 1,2,3,4
ADDR9: X1.A12 ; also sheet 1,2,3,4
ADDR10: X1.A13 ; also sheet 1,2,3,4
ADDR11: X1.A14 ; also sheet 1,2,3,4
ADDR12: X1.A15 ; also sheet 1,2,3,4
ADDR13: X1.A16 ; also sheet 1,2,3,4
ADDR14: X1.A17 ; also sheet 1,2,3,4
ADDR15: X1.A18 ; also sheet 1,2,3,4
ADDR-REG-ID0: X1.C3 ; also sheet 6
ADDR-REG-ID1: X1.C4 ; also sheet 6
ADDR-REG-ID2: X1.C5 ; also sheet 6
ADDR-REG-ID3: X1.C6 ; also sheet 6
ALU0: X1.C16
ALU1: X1.C17
ALU2: X1.C18
ALU3: X1.C19
BR-COND: X1.C24
DATA0: X1.A19 ; also sheet 7
DATA1: X1.A20 ; also sheet 7
DATA2: X1.A21 ; also sheet 7
DATA3: X1.A22 ; also sheet 7
DATA4: X1.A23 ; also sheet 7
DATA5: X1.A24 ; also sheet 7
DATA6: X1.A25 ; also sheet 7
DATA7: X1.A26 ; also sheet 7
DATA8: X1.A27 ; also sheet 7
DATA9: X1.A28 ; also sheet 7
DATA10: X1.A29 ; also sheet 7
DATA11: X1.A30 ; also sheet 7
DATA12: X1.B3 ; also sheet 7
DATA13: X1.B4 ; also sheet 7
DATA14: X1.B5 ; also sheet 7
DATA15: X1.B6 ; also sheet 7
GND: PWR.K(C) X1.A1 X1.A32 X1.B1 X1.B32 X1.C1 X1.C32 ; also sheet 5,7
IN: X1.C26
IOADDR0: X1.C7
IOADDR1: X1.C8
IOADDR2: X1.C9
IOADDR3: X1.C10
N$44: PWR.A R1.1
OUT: X1.C27
REG-LD-ID0: X1.B13 ; also sheet 6
REG-LD-ID1: X1.B14 ; also sheet 6
REG-LD-ID2: X1.B15 ; also sheet 6
REG-LD-ID3: X1.B16 ; also sheet 6
REG-RD-ID0: X1.B9 ; also sheet 6
REG-RD-ID1: X1.B10 ; also sheet 6
REG-RD-ID2: X1.B11 ; also sheet 6
REG-RD-ID3: X1.B12 ; also sheet 6
VCC: R1.2 X1.A2 X1.A31 X1.B2 X1.B31 X1.C2 X1.C31 ; also sheet 5

### Buses
-AC-LD,-AC-LD-INV,-AC-RD,ADDR[0..15],-ADDR-REG-LD[0..1],-ADDR-REG-RD[0..1],ALU[0..3],-ALU-FUNC,BR-COND,-BUS-EN,DATA[0..15],-HL-SWAP,IN,-INT,-INTA,IO-ADDR[0..3],-IO-ADDR-LD,-IO-RD,-IO-WR,-MEM-RD,-MEM-WR,OUT,-REG-DN,-REG-FUNC-LD,-REG-FUNC-RD,-REG-LD-HI,REG-LD-ID[0..3],-REG-LD-LO,-REG-RD-HI,REG-RD-ID[0..3],-REG-RD-LO,-REG-UP,-RESET,-RUN,-SR-LD,-TMP-REG-LD[0..1],-TMP-REG-RD[0..1],-VMA

## Power pins joined to a net without a drawn wire
GND: IC1.7(P:GND) IC2.7(P:GND) IC3.8(GND) IC4.8(GND) IC5.8(GND) IC6.8(GND) IC7.10(P:GND) IC8.10(P:GND) IC9.8(GND) IC10.8(GND) IC11.8(GND) IC12.8(GND) IC13.10(P:GND) IC14.10(P:GND) IC15.7(P:GND) IC17.10(P:GND) IC18.10(P:GND) IC19.8(GND) IC20.8(GND) IC21.8(GND) IC22.8(GND) IC23.10(P:GND) IC24.10(P:GND) IC25.7(P:GND) IC26.7(P:GND) IC27.10(P:GND) IC28.10(P:GND) IC29.8(GND) IC30.8(GND) IC31.7(P:GND) IC32.8(P:GND) IC33.8(P:GND) IC35.10(GND) IC36.10(GND) IC37.10(GND) IC38.8(P:GND) IC40.7(P:GND) IC41.10(P:GND) IC42.10(P:GND) IC43.8(GND) IC44.8(GND) IC45.10(P:GND) IC46.10(P:GND) IC47.7(P:GND) IC49.10(P:GND) IC50.10(P:GND)
VCC: IC1.14(P:VCC) IC2.14(P:VCC) IC3.16(VCC) IC4.16(VCC) IC5.16(VCC) IC6.16(VCC) IC7.20(P:VCC) IC8.20(P:VCC) IC9.16(VCC) IC10.16(VCC) IC11.16(VCC) IC12.16(VCC) IC13.20(P:VCC) IC14.20(P:VCC) IC15.14(P:VCC) IC17.20(P:VCC) IC18.20(P:VCC) IC19.16(VCC) IC20.16(VCC) IC21.16(VCC) IC22.16(VCC) IC23.20(P:VCC) IC24.20(P:VCC) IC25.14(P:VCC) IC26.14(P:VCC) IC27.20(P:VCC) IC28.20(P:VCC) IC29.16(VCC) IC30.16(VCC) IC31.14(P:VCC) IC32.16(P:VCC) IC33.16(P:VCC) IC35.20(VCC) IC36.20(VCC) IC37.20(VCC) IC38.16(P:VCC) IC40.14(P:VCC) IC41.20(P:VCC) IC42.20(P:VCC) IC43.16(VCC) IC44.16(VCC) IC45.20(P:VCC) IC46.20(P:VCC) IC47.14(P:VCC) IC49.20(P:VCC) IC50.20(P:VCC)
VDD: IC34.14(P:VDD)
VSS: IC34.7(P:VSS)

## Library data of the parts
C1-C6 C8-C38 = resistor:C-US: CAPACITOR, American symbol
IC1 IC2 IC15 IC25 IC26 IC31 IC40 IC47 = 74xx-us:74*32: Quad 2-input OR gate
IC3-IC6 IC9-IC12 IC19-IC22 IC29 IC30 IC43 IC44 = 74xx-us:74*192: Synchronous 4-bit UP/DOWN COUNTER
IC7 IC8 IC13 IC14 IC17 IC18 IC23 IC24 IC27 IC28 IC41 IC42 IC45 IC46 IC49 IC50 = 74xx-us:74*244: Octal BUFFER and LINE DRIVER, 3-state
IC32 IC33 IC38 = 74xx-us:74*139: Dual 2-line to 4-line DECODER/DEMULTIPLEXER
IC34 = 40xx:4077: Quad XNOR
IC35-IC37 = 74xx-us:74*245: Octal BUS TRANSCEIVER, 3-state
J1-J3 = SparkFun-Connectors:M04X2: .1" header, two rows of four.
PWR = led:LED: LED OSRAM: - CHIPLED LG R971, LG N971, LY N971, LG Q971, LY Q971, LO R971, LY R971 LH N974, LH R974 LS Q976, LO Q976, LY Q976 LO Q996 - Hyper CHIPLED LW Q18S LB Q993, LB Q99A, LB R99A - SideLED LS A670, LO A670, LY A670, LG A670, LP A670 LB A673, LV A673, LT A673, LW A673 LH A674 LY A675 LS A676, LA A676, LO A676, LY A676, LW A676 LS A679, LY A679, LG A679 - Hyper Micro SIDELED® LS Y876, LA Y876, LO Y876, LY Y876 LT Y87S - SmartLED LW L88C, LW L88S LB L89C, LB L89S, LG L890 LS L89K, LO L89K, LY L89K LS L896, LA L896, LO L896, LY L896 - TOPLED LS T670, LO T670, LY T670, LG T670, LP T670 LSG T670, LSP T670, LSY T670, LOP T670, LYG T670 LG T671, LOG T671, LSG T671 LB T673, LV T673, LT T673, LW T673 LH T674 LS T676, LA T676, LO T676, LY T676, LB T676, LH T676, LSB T676, LW T676 LB T67C, LV T67C, LT T67C, LS T67K, LO T67K, LY T67K, LW E67C LS E67B, LA E67B, LO E67B, LY E67B, LB E67C, LV E67C, LT E67C LW T67C LS T679, LY T679, LG T679 LS T770, LO T770, LY T770, LG T770, LP T770 LB T773, LV T773, LT T773, LW T773 LH T774 LS E675, LA E675, LY E675, LS T675 LS T776, LA T776, LO T776, LY T776, LB T776 LHGB T686 LT T68C, LB T68C - Hyper Mini TOPLED® LB M676 - Mini TOPLED Santana® LG M470 LS M47K, LO M47K, LY M47K Source: http://www.osram.convergy.de LUXEON: - LUMILED® LXK2-PW12-R00, LXK2-PW12-S00, LXK2-PW14-U00, LXK2-PW14-V00 LXK2-PM12-R00, LXK2-PM12-S00, LXK2-PM14-U00 LXK2-PE12-Q00, LXK2-PE12-R00, LXK2-PE12-S00, LXK2-PE14-T00, LXK2-PE14-U00 LXK2-PB12-K00, LXK2-PB12-L00, LXK2-PB12-M00, LXK2-PB14-N00, LXK2-PB14-P00, LXK2-PB14-Q00 LXK2-PR12-L00, LXK2-PR12-M00, LXK2-PR14-Q00, LXK2-PR14-R00 LXK2-PD12-Q00, LXK2-PD12-R00, LXK2-PD12-S00 LXK2-PH12-R00, LXK2-PH12-S00 LXK2-PL12-P00, LXK2-PL12-Q00, LXK2-PL12-R00 Source: www.luxeon.com KINGBRIGHT: KA-3528ASYC Source: www.kingbright.com
R1 = eagle-ltspice:R: RESISTOR, European symbol; SPICEMODEL: NONE; SPICEPREFIX: R
RN1 RN2 = resistor-net:RNX8: RESISTOR NETWORK; OC_FARNELL: unknown; OC_NEWARK: unknown
X1 = con-vg:FABC96R: CONNECTOR female, 96 pins, type R, rows ABC, grid 2.54 mm